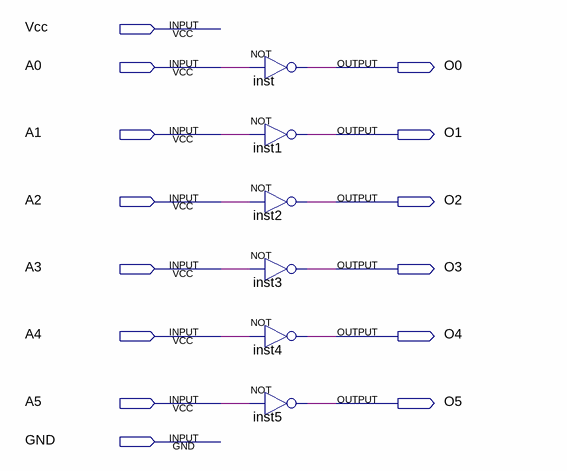
[diagram p0: schematic sheet]
// Quartus schematic 7404.bdf as structural Verilog: 6 symbols, 14 pins
module \7404  (
  input  Vcc,
  input  A0,
  input  A1,
  input  A2,
  input  A3,
  input  A4,
  input  A5,
  input  GND,
  output O0,
  output O1,
  output O2,
  output O3,
  output O4,
  output O5
);

  not inst (O0, A0);
  not inst1 (O1, A1);
  not inst2 (O2, A2);
  not inst3 (O3, A3);
  not inst4 (O4, A4);
  not inst5 (O5, A5);
endmodule
